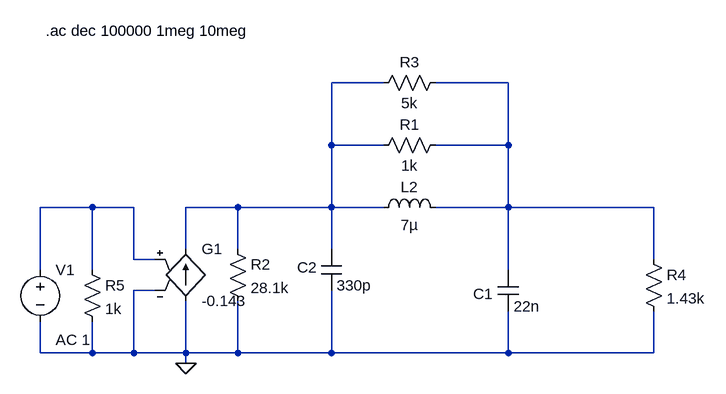
[diagram p0: schematic lc_clase2.asc]
lc_clase2.asc, the LTspice schematic file:
Version 4
SHEET 1 880 680
WIRE 208 -80 128 -80
WIRE 400 -80 288 -80
WIRE 128 16 128 -80
WIRE 208 16 128 16
WIRE 400 16 400 -80
WIRE 400 16 288 16
WIRE -240 112 -320 112
WIRE -176 112 -240 112
WIRE -16 112 -96 112
WIRE 128 112 128 16
WIRE 128 112 -16 112
WIRE 208 112 128 112
WIRE 400 112 400 16
WIRE 400 112 288 112
WIRE 624 112 400 112
WIRE -96 176 -96 112
WIRE -16 176 -16 112
WIRE 128 176 128 112
WIRE -176 192 -176 112
WIRE -144 192 -176 192
WIRE 624 192 624 112
WIRE -320 208 -320 112
WIRE -240 208 -240 112
WIRE 400 208 400 112
WIRE -144 240 -176 240
WIRE -320 336 -320 288
WIRE -240 336 -240 288
WIRE -240 336 -320 336
WIRE -176 336 -176 240
WIRE -176 336 -240 336
WIRE -96 336 -96 256
WIRE -96 336 -176 336
WIRE -16 336 -16 256
WIRE -16 336 -96 336
WIRE 128 336 128 240
WIRE 128 336 -16 336
WIRE 400 336 400 272
WIRE 400 336 128 336
WIRE 624 336 624 272
WIRE 624 336 400 336
WIRE -96 352 -96 336
FLAG -96 352 0
SYMBOL ind 192 128 R270
WINDOW 0 32 56 VTop 2
WINDOW 3 5 56 VBottom 2
SYMATTR InstName L2
SYMATTR Value 7µ
SYMBOL cap 112 176 R0
WINDOW 0 -37 28 Left 2
SYMATTR InstName C2
SYMATTR Value 330p
SYMBOL cap 384 208 R0
WINDOW 0 -38 37 Left 2
SYMATTR InstName C1
SYMATTR Value 22n
SYMBOL g -96 160 R0
SYMATTR InstName G1
SYMATTR Value -0.143
SYMBOL res -32 160 R0
SYMATTR InstName R2
SYMATTR Value 28.1k
SYMBOL res 304 0 R90
WINDOW 0 0 56 VBottom 2
WINDOW 3 32 56 VTop 2
SYMATTR InstName R1
SYMATTR Value 1k
SYMBOL res 304 -96 R90
WINDOW 0 0 56 VBottom 2
WINDOW 3 32 56 VTop 2
SYMATTR InstName R3
SYMATTR Value 5k
SYMBOL res 608 176 R0
SYMATTR InstName R4
SYMATTR Value 1.43k
SYMBOL voltage -320 192 R0
WINDOW 123 24 124 Left 2
WINDOW 39 0 0 Left 0
SYMATTR InstName V1
SYMATTR Value ""
SYMATTR Value2 AC 1
SYMBOL res -256 192 R0
SYMATTR InstName R5
SYMATTR Value 1k
TEXT -312 -160 Left 2 !.ac dec 100000 1meg 10meg

The netlist it stands for:
* lc_clase2.asc
L2 N001 N002 7µ
C2 N001 0 330p
C1 N002 0 22n
G1 0 N001 N003 0 -0.143
R2 N001 0 28.1k
R1 N002 N001 1k
R3 N002 N001 5k
R4 N002 0 1.43k
V1 N003 0 AC 1
R5 N003 0 1k
.ac dec 100000 1meg 10meg
.backanno
.end